# Altium schematic sheet top.SchDoc
size A4
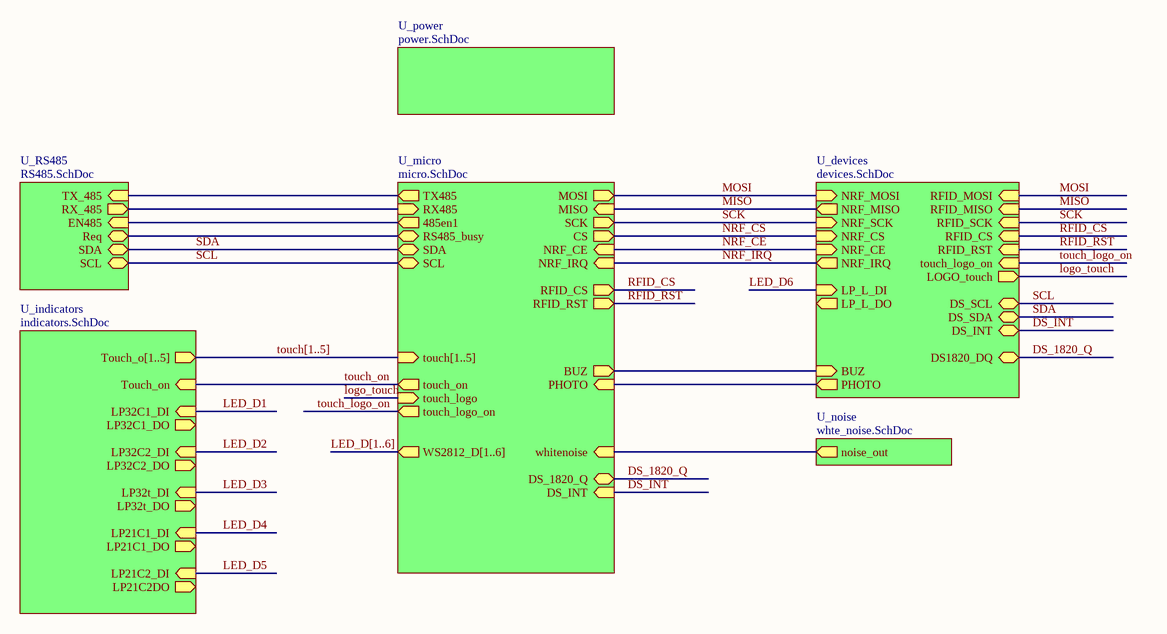
[diagram p0: top.SchDoc]

## Sub-sheets
U_devices = devices.SchDoc: NRF_MISO (out), NRF_SCK (in), NRF_CE (in), NRF_IRQ (out), NRF_CS (in), NRF_MOSI (in), BUZ (in), PHOTO (out), DS_SCL (bidir), DS_SDA (bidir), DS_INT (bidir), DS1820_DQ (bidir), LOGO_touch (out), RFID_CS (in), RFID_MISO (in), RFID_RST (in), RFID_SCK (in), RFID_MOSI (in), LP_L_DI (in), LP_L_DO (out), touch_logo_on (in)
U_indicators = indicators.SchDoc: LP32C1_DI (in), LP21C1_DI (in), Touch_o[1..5] (out), LP32t_DO (out), LP32t_DI (in), LP32C1_DO (out), LP21C1_DO (out), Touch_on (in), LP21C2DO (out), LP32C2_DO (out), LP32C2_DI (in), LP21C2_DI (in)
U_micro = micro.SchDoc: whitenoise (in), SCL (bidir), SDA (bidir), RX485 (in), TX485 (out), 485en1 (out), RS485_busy (bidir), MOSI (out), MISO (in), SCK (out), CS (out), DS_INT (in), PHOTO (in), touch[1..5] (in), NRF_CE (in), NRF_IRQ (in), DS_1820_Q (bidir), BUZ (out), touch_on (out), touch_logo (in), WS2812_D[1..6] (out), RFID_CS (out), RFID_RST (out), touch_logo_on (out)
U_noise = whte_noise.SchDoc: noise_out (out)
U_power = power.SchDoc: no entries
U_RS485 = RS485.SchDoc: RX_485 (out), EN485 (in), TX_485 (in), Req (bidir), SDA (bidir), SCL (bidir)

## Nets
DS_1820_Q: sheet U_micro/DS_1820_Q, sheet U_devices/DS1820_DQ
DS_INT: sheet U_micro/DS_INT, sheet U_devices/DS_INT
LED_D1: sheet U_indicators/LP32C1_DI
LED_D2: sheet U_indicators/LP32C2_DI
LED_D3: sheet U_indicators/LP32t_DI
LED_D4: sheet U_indicators/LP21C1_DI
LED_D5: sheet U_indicators/LP21C2_DI
LED_D6: sheet U_devices/LP_L_DI
logo_touch: sheet U_micro/touch_logo, sheet U_devices/LOGO_touch
MISO: sheet U_micro/MISO, sheet U_devices/NRF_MISO, sheet U_devices/RFID_MISO
MOSI: sheet U_micro/MOSI, sheet U_devices/NRF_MOSI, sheet U_devices/RFID_MOSI
NRF_CE: sheet U_micro/NRF_CE, sheet U_devices/NRF_CE
NRF_CS: sheet U_micro/CS, sheet U_devices/NRF_CS
NRF_IRQ: sheet U_micro/NRF_IRQ, sheet U_devices/NRF_IRQ
RFID_CS: sheet U_micro/RFID_CS, sheet U_devices/RFID_CS
RFID_RST: sheet U_micro/RFID_RST, sheet U_devices/RFID_RST
SCK: sheet U_micro/SCK, sheet U_devices/NRF_SCK, sheet U_devices/RFID_SCK
SCL: sheet U_micro/SCL, sheet U_devices/DS_SCL, sheet U_RS485/SCL
SDA: sheet U_micro/SDA, sheet U_devices/DS_SDA, sheet U_RS485/SDA
touch_logo_on: sheet U_micro/touch_logo_on, sheet U_devices/touch_logo_on
touch_on: sheet U_micro/touch_on, sheet U_indicators/Touch_on
(unnamed): sheet U_micro/whitenoise, sheet U_noise/noise_out
(unnamed): sheet U_micro/RX485, sheet U_RS485/RX_485
(unnamed): sheet U_micro/TX485, sheet U_RS485/TX_485
(unnamed): sheet U_micro/485en1, sheet U_RS485/EN485
(unnamed): sheet U_micro/RS485_busy, sheet U_RS485/Req
(unnamed): sheet U_micro/PHOTO, sheet U_devices/PHOTO
(unnamed): sheet U_micro/BUZ, sheet U_devices/BUZ

## Buses and harness runs
bus LED_D[1..6] = sheet U_micro/WS2812_D[1..6]
bus touch[1..5] = sheet U_indicators/Touch_o[1..5] = sheet U_micro/touch[1..5]